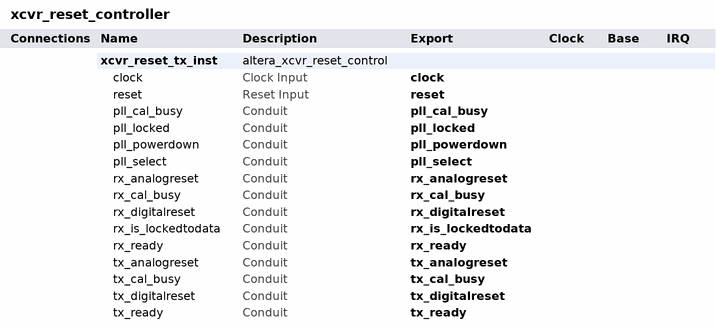
[diagram p0: system contents]
# Platform Designer (Qsys) system xcvr_reset_controller, Arria 10 10AXF40AA
# Parameters at their usual value, and those the tool derives, are not listed.
package require -exact qsys 20.1
create_system xcvr_reset_controller
set_project_property DEVICE_FAMILY {Arria 10}
set_project_property DEVICE 10AXF40AA

add_instance xcvr_reset_tx_inst altera_xcvr_reset_control 20.1
set_instance_property xcvr_reset_tx_inst AUTO_EXPORT true
set_instance_parameter_value xcvr_reset_tx_inst CHANNELS 4
set_instance_parameter_value xcvr_reset_tx_inst RX_PER_CHANNEL 0
set_instance_parameter_value xcvr_reset_tx_inst SYS_CLK_IN_MHZ 100
set_instance_parameter_value xcvr_reset_tx_inst TX_PLL_ENABLE 1
set_instance_parameter_value xcvr_reset_tx_inst T_RX_ANALOGRESET 70000
set_instance_parameter_value xcvr_reset_tx_inst T_RX_DIGITALRESET 400000
set_instance_parameter_value xcvr_reset_tx_inst T_TX_ANALOGRESET 70000
set_instance_parameter_value xcvr_reset_tx_inst T_TX_DIGITALRESET 70000
set_instance_parameter_value xcvr_reset_tx_inst gui_pll_cal_busy 1
set_instance_parameter_value xcvr_reset_tx_inst gui_tx_auto_reset 1

# exported interfaces
add_interface clock clock sink
set_interface_property clock EXPORT_OF xcvr_reset_tx_inst.clock
add_interface pll_cal_busy conduit end
set_interface_property pll_cal_busy EXPORT_OF xcvr_reset_tx_inst.pll_cal_busy
add_interface pll_locked conduit end
set_interface_property pll_locked EXPORT_OF xcvr_reset_tx_inst.pll_locked
add_interface pll_powerdown conduit end
set_interface_property pll_powerdown EXPORT_OF xcvr_reset_tx_inst.pll_powerdown
add_interface pll_select conduit end
set_interface_property pll_select EXPORT_OF xcvr_reset_tx_inst.pll_select
add_interface reset reset sink
set_interface_property reset EXPORT_OF xcvr_reset_tx_inst.reset
add_interface rx_analogreset conduit end
set_interface_property rx_analogreset EXPORT_OF xcvr_reset_tx_inst.rx_analogreset
add_interface rx_cal_busy conduit end
set_interface_property rx_cal_busy EXPORT_OF xcvr_reset_tx_inst.rx_cal_busy
add_interface rx_digitalreset conduit end
set_interface_property rx_digitalreset EXPORT_OF xcvr_reset_tx_inst.rx_digitalreset
add_interface rx_is_lockedtodata conduit end
set_interface_property rx_is_lockedtodata EXPORT_OF xcvr_reset_tx_inst.rx_is_lockedtodata
add_interface rx_ready conduit end
set_interface_property rx_ready EXPORT_OF xcvr_reset_tx_inst.rx_ready
add_interface tx_analogreset conduit end
set_interface_property tx_analogreset EXPORT_OF xcvr_reset_tx_inst.tx_analogreset
add_interface tx_cal_busy conduit end
set_interface_property tx_cal_busy EXPORT_OF xcvr_reset_tx_inst.tx_cal_busy
add_interface tx_digitalreset conduit end
set_interface_property tx_digitalreset EXPORT_OF xcvr_reset_tx_inst.tx_digitalreset
add_interface tx_ready conduit end
set_interface_property tx_ready EXPORT_OF xcvr_reset_tx_inst.tx_ready

set_interconnect_requirement {$system} qsys_mm.clockCrossingAdapter HANDSHAKE
set_interconnect_requirement {$system} qsys_mm.insertDefaultSlave FALSE
set_interconnect_requirement {$system} qsys_mm.maxAdditionalLatency 1

save_system xcvr_reset_controller.qsys
